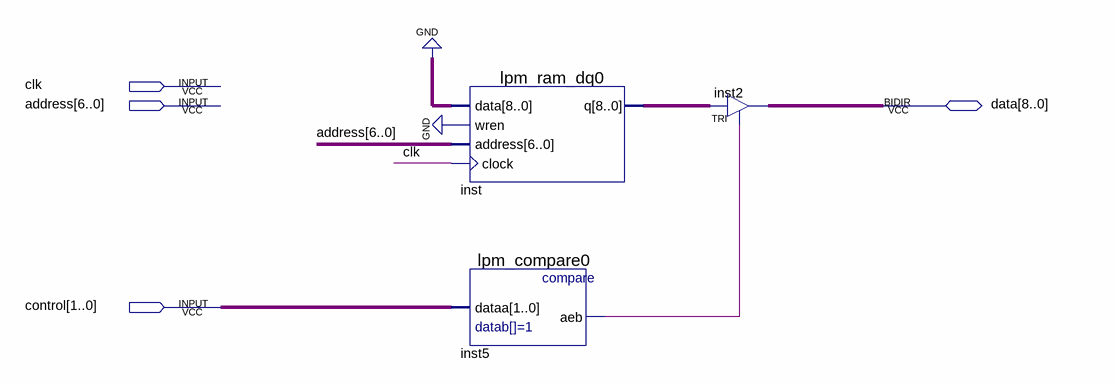
[diagram p0: schematic sheet]
// Quartus schematic RAM.bdf as structural Verilog: 3 symbols, 4 pins
module RAM (
  input  clk,
  input  [6:0] address,
  input  [1:0] control,
  inout  [8:0] data
);

  wire inst5_aeb;
  wire [8:0] inst_q;

  lpm_ram_dq0 inst (.data({9{1'b0}}), .wren(1'b0), .address(address), .clock(clk), .q(inst_q));
  lpm_compare0 inst5 (.dataa(control), .aeb(inst5_aeb));
  TRI inst2[8:0] (.IN(inst_q), .OE(inst5_aeb), .OUT(data));
endmodule
